# Altium schematic sheet INF_Processing.SchDoc
size A4; Author: Yaokun/Felix Zhang; Organization: Altium Limited; Address1: 21A144; Address2: Harbin Engineering University; Address3: Harbin; Address4: CHINA
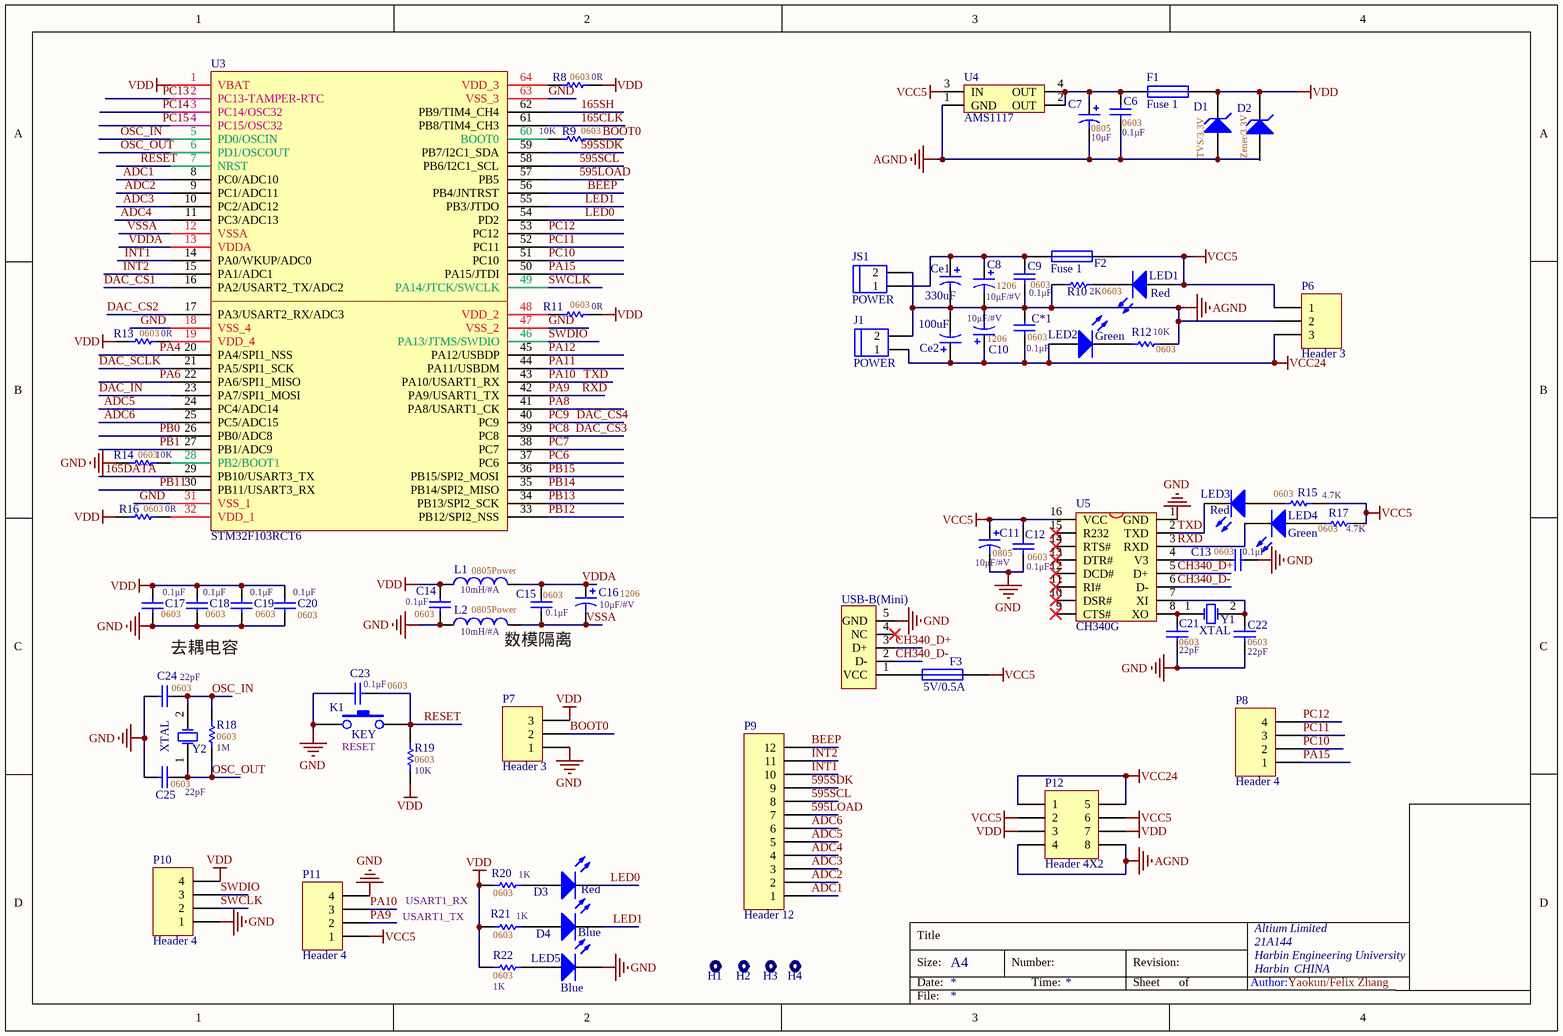
[diagram p0: INF_Processing.SchDoc]

## Parts
C6  value 0.1μF  [CAP_0603_16*08]  (hidden comment: 0603)
C7  value 10μF  PackageReference: 0805  [CAP_0805_20*12]  (hidden comment: Polar)
C8  value 10μF/#V  PackageReference: 1206  [CAP_1206]  (hidden comment: Polar)
C9  value 0.1μF  [CAP_0603_16*08]  (hidden comment: 0603)
C10  value 10μF/#V  PackageReference: 1206  [CAP_1206]  (hidden comment: Polar)
C11  value 10μF/#V  PackageReference: 0805  [CAP_0805_20*12]  (hidden comment: Polar)
C12  value 0.1μF  [CAP_0603_16*08]  (hidden comment: 0603)
C13  value 0.1μF  [CAP_0603_16*08]  (hidden comment: 0603)
C14  value 0.1μF  [CAP_0603_16*08]  (hidden comment: 0603)
C15  value 0.1μF  [CAP_0603_16*08]  (hidden comment: 0603)
C16  value 10μF/#V  PackageReference: 1206  [CAP_0805_20*12]  (hidden comment: Polar)
C17  value 0.1μF  [CAP_0603_16*08]  (hidden comment: 0603)
C18  value 0.1μF  [CAP_0603_16*08]  (hidden comment: 0603)
C19  value 0.1μF  [CAP_0603_16*08]  (hidden comment: 0603)
C20  value 0.1μF  [CAP_0603_16*08]  (hidden comment: 0603)
C21  value 22pF  [CAP_0603_16*08]  (hidden comment: 0603)
C22  value 22pF  [CAP_0603_16*08]  (hidden comment: 0603)
C23  value 0.1μF  [CAP_0603_16*08]  (hidden comment: 0603)
C24  value 22pF  [CAP_0603_16*08]  (hidden comment: 0603)
C25  value 22pF  [CAP_0603_16*08]  (hidden comment: 0603)
C*1  value 0.1μF  [CAP_0603_16*08]  (hidden comment: 0603)
Ce1  330uF  [Cap_elc_330uF16V]
Ce2  100uF  [Cap_elc_100uF35V]
D1  TVS/3.3V  [SOD523]
D2  Zener/3.3V  [SOD323]
D3  Red  [LED_0805]
D4  Blue  [LED_0805]
F1  Fuse 1  [RES_0805_20*12]
F2  Fuse 1  [FUSE3.5*5.5]
F3  5V/0.5A  [RES_0805_20*12]
H1  Pad3mm  [PAD]  (value not drawn)
H2  Pad3mm  [PAD]  (value not drawn)
H3  Pad3mm  [PAD]  (value not drawn)
H4  Pad3mm  [PAD]  (value not drawn)
J1  POWER  [Header2_press]
JS1  POWER  [Header2_press]
K1  KEY  [KEY_4]
L1  value 10mH/#A  PackageReference: 0805  PackageDescription: Power  [IND_0805_20*12]  (hidden comment: MODEL?)
L2  value 10mH/#A  PackageReference: 0805  PackageDescription: Power  [IND_0805_20*12]  (hidden comment: MODEL?)
LED1  Red  [LED_0805]
LED2  Green  [LED_0805]
LED3  Red  [CAP_0603_16*08]
LED4  Green  [CAP_0603_16*08]
LED5  Blue  [LED_0805]
P6  Header 3  [Header3_HC5.08]
P7  Header 3  [HEADER1*3_PIN]
P8  Header 4  [HEADER1*4_PIN]
P9  Header 12  [P12_OUT]
P10  Header 4  [P4_OUT]
P11  Header 4  [HEADER1*4_PIN]
P12  Header 4X2  [HEADER2*4_PIN]
R8  value 0R  PackageReference: 0603  [RES_0603_16*08]  (hidden comment: SMD)
R9  value 10K  PackageReference: 0603  [RES_0603_16*08]  (hidden comment: SMD)
R10  value 2K  PackageReference: 0603  [RES_0805_20*12]  (hidden comment: SMD)
R11  value 0R  PackageReference: 0603  [RES_0603_16*08]  (hidden comment: SMD)
R12  value 10K  PackageReference: 0603  [RES_0805_20*12]  (hidden comment: SMD)
R13  value 0R  PackageReference: 0603  [RES_0603_16*08]  (hidden comment: SMD)
R14  value 10K  PackageReference: 0603  [RES_0603_16*08]  (hidden comment: SMD)
R15  value 4.7K  PackageReference: 0603  [RES_0603_16*08]  (hidden comment: SMD)
R16  value 0R  PackageReference: 0603  [RES_0603_16*08]  (hidden comment: SMD)
R17  value 4.7K  PackageReference: 0603  [RES_0603_16*08]  (hidden comment: SMD)
R18  value 1M  PackageReference: 0603  [RES_0805_20*12]  (hidden comment: SMD)
R19  value 10K  PackageReference: 0603  [RES_0603_16*08]  (hidden comment: SMD)
R20  value 1K  PackageReference: 0603  [RES_0805_20*12]  (hidden comment: SMD)
R21  value 1K  PackageReference: 0603  [RES_0805_20*12]  (hidden comment: SMD)
R22  value 1K  PackageReference: 0603  [RES_0805_20*12]  (hidden comment: SMD)
U3  STM32F103RCT6  [LQFP64_N]
U4  AMS1117  [SOT223_M]
U5  CH340G  [SOP16]
USB_SLAVE1  USB-B(Mini)  [USB/SM0.8-6H5]
Y1  XTAL  [XTAL_US]
Y2  XTAL  [XTAL_US]

## Nets
AGND: C6.1 C7.2 C8.2 C9.1 C10.2 C*1.2 Ce1.2 Ce2.2 D1.1(A) D2.1(A) J1.2 JS1.2 P6.2 P12.4 P12.8 R10.1 R12.2 U4.1(GND)
GND: C11.2 C12.1 C13.2 C14.1 C17.2 C18.2 C19.2 C20.1 C21.1 C22.1 C23.1 C24.2 C25.2 K1.1 L2.1 LED5.2(K) P7.1 P10.1 P11.4 R14.1 U3.18(VSS_4) U3.31(VSS_1) U3.47(VSS_2) U3.63(VSS_3) U5.1(GND) USB_SLAVE1.5(GND)
VCC5: C11.1 C12.2 F2.2 F3.2 LED1.1(A) P6.1 P11.1 P12.2 P12.6 R15.2 R17.1 U4.3(IN) U5.16(VCC)
VCC24: C10.1 C*1.1 Ce2.1(+) J1.1 LED2.1(A) P6.3 P12.1 P12.5
VDD: C14.2 C17.1 C18.1 C19.1 C20.2 D1.2(K) D2.2(K) F1.2 L1.1 P7.3 P10.4 P12.3 P12.7 R8.2 R11.2 R13.1 R16.1 R19.1 R20.1 R21.1 R22.2 U3.1(VBAT)
165CLK: U3.61(PB8/TIM4_CH3)
165DATA: U3.29(PB10/USART3_TX)
165SH: U3.62(PB9/TIM4_CH4)
595LOAD: P9.7 U3.57(PB5)
595SCL: P9.8 U3.58(PB6/I2C1_SCL)
595SDK: P9.9 U3.59(PB7/I2C1_SDA)
ADC1: P9.1 U3.8(PC0/ADC10)
ADC2: P9.2 U3.9(PC1/ADC11)
ADC3: P9.3 U3.10(PC2/ADC12)
ADC4: P9.4 U3.11(PC3/ADC13)
ADC5: P9.5 U3.24(PC4/ADC14)
ADC6: P9.6 U3.25(PC5/ADC15)
BEEP: P9.12 U3.56(PB4/JNTRST)
BOOT0: P7.2 R9.1
CH340_D+: U5.5(D+) USB_SLAVE1.3(D+)
CH340_D-: U5.6(D-) USB_SLAVE1.2(D-)
DAC_CS1: U3.16(PA2/USART2_TX/ADC2)
DAC_CS2: U3.17(PA3/USART2_RX/ADC3)
DAC_CS3: U3.39(PC8)  [also labelled PC8]
DAC_CS4: U3.40(PC9)  [also labelled PC9]
DAC_IN: U3.23(PA7/SPI1_MOSI)
DAC_SCLK: U3.21(PA5/SPI1_SCK)
INT1: P9.10 U3.14(PA0/WKUP/ADC0)
INT2: P9.11 U3.15(PA1/ADC1)
LED0: D3.2(K) U3.54(PD2)
LED1: D4.2(K) U3.55(PB3/JTDO)
OSC_IN: C24.1 R18.2 U3.5(PD0/OSCIN) Y2.2(OSC2)
OSC_OUT: C25.1 R18.1 U3.6(PD1/OSCOUT) Y2.1(OSC1)
PA4: U3.20(PA4/SPI1_NSS)
PA6: U3.22(PA6/SPI1_MISO)
PA8: U3.41(PA8/USART1_CK)
PA9: LED4.2(K) P11.2 U3.42(PA9/USART1_TX) U5.3(RXD)  [also labelled RXD]
PA10: LED3.2(K) P11.3 U3.43(PA10/USART1_RX) U5.2(TXD)  [also labelled TXD]
PA11: U3.44(PA11/USBDM)
PA12: U3.45(PA12/USBDP)
PA15: P8.1 U3.50(PA15/JTDI)
PB0: U3.26(PB0/ADC8)
PB1: U3.27(PB1/ADC9)
PB11: U3.30(PB11/USART3_RX)
PB12: U3.33(PB12/SPI2_NSS)
PB13: U3.34(PB13/SPI2_SCK)
PB14: U3.35(PB14/SPI2_MISO)
PB15: U3.36(PB15/SPI2_MOSI)
PC6: U3.37(PC6)
PC7: U3.38(PC7)
PC10: P8.2 U3.51(PC10)
PC11: P8.3 U3.52(PC11)
PC12: P8.4 U3.53(PC12)
PC13: U3.2(PC13-TAMPER-RTC)
PC14: U3.3(PC14/OSC32)
PC15: U3.4(PC15/OSC32)
RESET: C23.2 K1.2 R19.2 U3.7(NRST)
SWCLK: P10.2 U3.49(PA14/JTCK/SWCLK)
SWDIO: P10.3 U3.46(PA13/JTMS/SWDIO)
VDDA: C15.2 C16.1 L1.2 U3.13(VDDA)
VSSA: C15.1 C16.2 L2.2 U3.12(VSSA)
NetC6_2: C6.2 C7.1 F1.1 U4.2(OUT) U4.4(OUT)
NetC8_1: C8.1 C9.2 Ce1.1(+) F2.1 JS1.1
NetC13_1: C13.1 U5.4(V3)
NetC21_2: C21.2 U5.8(XO) Y1.1(OSC1)
NetC22_2: C22.2 U5.7(XI) Y1.2(OSC2)
NetD3_1: D3.1(A) R20.2
NetD4_1: D4.1(A) R21.2
NetF3_1: F3.1 USB_SLAVE1.1(VCC)
NetLED1_2: LED1.2(K) R10.2
NetLED2_2: LED2.2(K) R12.1
NetLED3_1: LED3.1(A) R15.1
NetLED4_1: LED4.1(A) R17.2
NetLED5_1: LED5.1(A) R22.1
NetR8_1: R8.1 U3.64(VDD_3)
NetR9_2: R9.2 U3.60(BOOT0)
NetR11_1: R11.1 U3.48(VDD_2)
NetR13_2: R13.2 U3.19(VDD_4)
NetR14_2: R14.2 U3.28(PB2/BOOT1)
NetR16_2: R16.2 U3.32(VDD_1)

Not connected (* = marked no-connect by the designer): U5 9(CTS#)* 10(DSR#)* 11(RI#)* 12(DCD#)* 13(DTR#)* 14(RTS#)* 15(R232)*; USB_SLAVE1 4(NC)*

## Notes on the sheet
- 去耦电容
- (near L2) 数模隔离
- USART1_TX
- USART1_RX
- Title
- Size:
- Date:
- A4
- Number:
- Time:
- Revision:
- Sheet
- of
- Author:
- File:
- (in symbol KEY) RESET

## Library data of the parts
C6 C9 C12-C15 C17-C25 C*1 = Cap: Capacitor; Published: 8-Jun-2000; LatestRevisionDate: 17-Jul-2002; LatestRevisionNote: Re-released for DXP Platform.; Publisher: Altium Limited; PackageDescription: 0603; PackageReference: 0603
C7 C8 C10 C11 C16 = Cap Pol: Polarized Capacitor (Axial); LatestRevisionDate: 17-Jul-2002; LatestRevisionNote: Re-released for DXP Platform.; Publisher: Altium Limited; Published: 1206; PackageDescription: Polar
Ce1 Ce2 = Cap Elec
D1 D2 = D Zener: Zener Diode; Published: 8-Jun-2000; LatestRevisionDate: 17-Jul-2002; LatestRevisionNote: Re-released for DXP Platform.; PackageReference: DIODE-0.7; Publisher: Altium Limited; PackageDescription: Diode, Thru-Hole; 2 Leads; 0.7 in Pin Spacing
D3 D4 LED1-LED5 = LED: Typical RED, GREEN, YELLOW, AMBER GaAs LED; Published: 8-Jun-2000; LatestRevisionDate: 17-Jul-2002; LatestRevisionNote: Re-released for DXP Platform.; PackageVersion: Feb-2002; PackageReference: 3.2X1.6X1.1; Publisher: Altium Limited; PackageDescription: SM LED; 2 Flat Leads
F1-F3 = Fuse 1: Fuse; Published: 8-Jun-2000; LatestRevisionDate: 17-Jul-2002; LatestRevisionNote: Re-released for DXP Platform.; PackageReference: PIN-W2/E2.8; Publisher: Altium Limited; PackageDescription: Thru-Hole; 2 Leads
J1 JS1 = HEAD2
L1 L2 = Inductor: Code_IEC: 1005; Published: 8-Jun-2000; LatestRevisionDate: 29-May-2009; LatestRevisionNote: IPC-7351 Footprint Added.; Publisher: Altium Limited; Code_JEITA: 0402
P6 P7 = Header 3: Header, 3-Pin; LatestRevisionDate: 17-Jul-2002; LatestRevisionNote: Re-released for DXP Platform.; Publisher: Altium Limited
P8 P10 P11 = Header 4: Header, 4-Pin; LatestRevisionDate: 17-Jul-2002; LatestRevisionNote: Re-released for DXP Platform.; Publisher: Altium Limited
P9 = Header 12: Header, 12-Pin; LatestRevisionDate: 17-Jul-2002; LatestRevisionNote: Re-released for DXP Platform.; Publisher: Altium Limited
P12 = Header 4X2: Header, 4-Pin, Dual row; LatestRevisionDate: 17-Jul-2002; LatestRevisionNote: Re-released for DXP Platform.; Publisher: Altium Limited
R8-R22 = RES_SMD: Resistor; Published: 8-Jun-2000; LatestRevisionDate: 17-Jul-2002; LatestRevisionNote: Re-released for DXP Platform.; Publisher: Altium Limited; PackageDescription: SMD
U3 = STM32F103RBT6
U5 = CH340G: USB2UART
USB_SLAVE1 = USB5
Y1 Y2 = XTAL: Crystal Oscillator; Published: 8-Jun-2000; LatestRevisionDate: 17-Jul-2002; LatestRevisionNote: Re-released for DXP Platform.; PackageReference: R38; Publisher: Altium Limited; PackageDescription: Crystal, Thru-Hole; 2 Leads; Body 3.1 x 8.2 mm (Dia.xH)